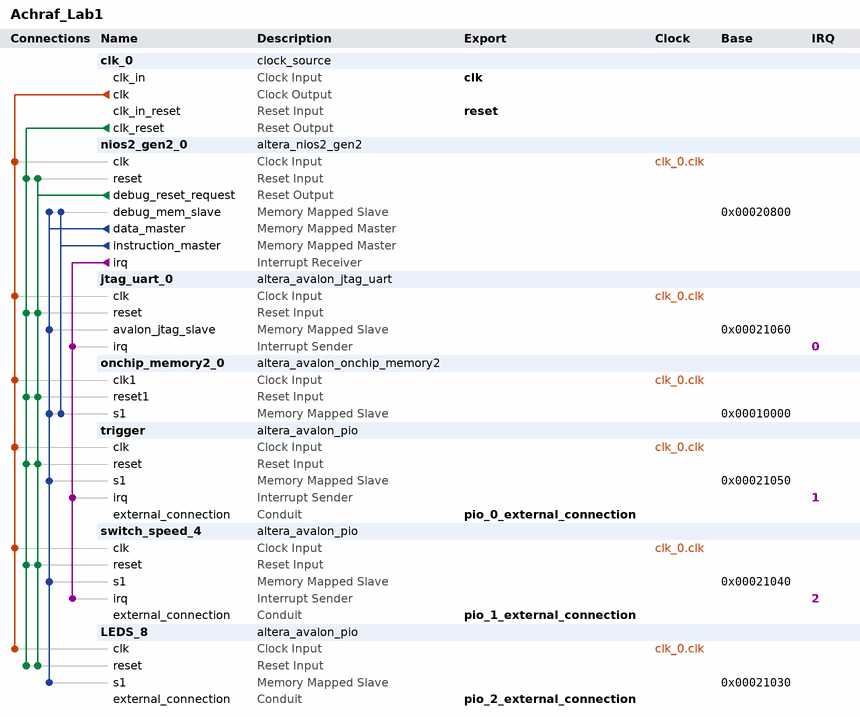
[diagram p0: system contents]
# Platform Designer (Qsys) system Achraf_Lab1, MAX 10 10M50DAF484C7G
# Parameters at their usual value, and those the tool derives, are not listed.
package require -exact qsys 18.1
create_system Achraf_Lab1
set_project_property DEVICE_FAMILY {MAX 10}
set_project_property DEVICE 10M50DAF484C7G

add_instance clk_0 clock_source 18.1
set_instance_parameter_value clk_0 clockFrequency 50000000

add_instance nios2_gen2_0 altera_nios2_gen2 18.1
set_instance_parameter_value nios2_gen2_0 dcache_size 2048
set_instance_parameter_value nios2_gen2_0 exceptionSlave onchip_memory2_0.s1
set_instance_parameter_value nios2_gen2_0 icache_size 4096
set_instance_parameter_value nios2_gen2_0 impl Tiny
set_instance_parameter_value nios2_gen2_0 resetSlave onchip_memory2_0.s1

add_instance jtag_uart_0 altera_avalon_jtag_uart 18.1
set_instance_parameter_value jtag_uart_0 simInteractiveOptions NO_INTERACTIVE_WINDOWS

add_instance onchip_memory2_0 altera_avalon_onchip_memory2 18.1
set_instance_parameter_value onchip_memory2_0 dataWidth 32
set_instance_parameter_value onchip_memory2_0 dualPort false
set_instance_parameter_value onchip_memory2_0 initMemContent true
set_instance_parameter_value onchip_memory2_0 initializationFileName E:/PortableGit/TAIBI_Lab1/software/app/mem_init/Achraf_Lab1_onchip_memory2_0.hex
set_instance_parameter_value onchip_memory2_0 memorySize 40000
set_instance_parameter_value onchip_memory2_0 useNonDefaultInitFile true

add_instance trigger altera_avalon_pio 18.1
set_instance_parameter_value trigger captureEdge true
set_instance_parameter_value trigger direction Input
set_instance_parameter_value trigger edgeType FALLING
set_instance_parameter_value trigger generateIRQ true
set_instance_parameter_value trigger irqType EDGE
set_instance_parameter_value trigger width 1

add_instance switch_speed_4 altera_avalon_pio 18.1
set_instance_parameter_value switch_speed_4 bitClearingEdgeCapReg true
set_instance_parameter_value switch_speed_4 captureEdge true
set_instance_parameter_value switch_speed_4 direction Input
set_instance_parameter_value switch_speed_4 edgeType FALLING
set_instance_parameter_value switch_speed_4 generateIRQ true
set_instance_parameter_value switch_speed_4 irqType EDGE
set_instance_parameter_value switch_speed_4 width 4

add_instance LEDS_8 altera_avalon_pio 18.1
set_instance_parameter_value LEDS_8 direction Output
set_instance_parameter_value LEDS_8 width 8

# connections
add_connection clk_0.clk jtag_uart_0.clk clock
add_connection clk_0.clk LEDS_8.clk clock
add_connection clk_0.clk nios2_gen2_0.clk clock
add_connection clk_0.clk onchip_memory2_0.clk1 clock
add_connection clk_0.clk switch_speed_4.clk clock
add_connection clk_0.clk trigger.clk clock
add_connection clk_0.clk_reset jtag_uart_0.reset reset
add_connection clk_0.clk_reset LEDS_8.reset reset
add_connection clk_0.clk_reset nios2_gen2_0.reset reset
add_connection clk_0.clk_reset onchip_memory2_0.reset1 reset
add_connection clk_0.clk_reset switch_speed_4.reset reset
add_connection clk_0.clk_reset trigger.reset reset
add_connection nios2_gen2_0.debug_reset_request jtag_uart_0.reset reset
add_connection nios2_gen2_0.debug_reset_request LEDS_8.reset reset
add_connection nios2_gen2_0.debug_reset_request nios2_gen2_0.reset reset
add_connection nios2_gen2_0.debug_reset_request onchip_memory2_0.reset1 reset
add_connection nios2_gen2_0.debug_reset_request switch_speed_4.reset reset
add_connection nios2_gen2_0.debug_reset_request trigger.reset reset
add_connection nios2_gen2_0.data_master jtag_uart_0.avalon_jtag_slave avalon
set_connection_parameter_value nios2_gen2_0.data_master/jtag_uart_0.avalon_jtag_slave baseAddress 0x00021060
add_connection nios2_gen2_0.data_master LEDS_8.s1 avalon
set_connection_parameter_value nios2_gen2_0.data_master/LEDS_8.s1 baseAddress 0x00021030
add_connection nios2_gen2_0.data_master nios2_gen2_0.debug_mem_slave avalon
set_connection_parameter_value nios2_gen2_0.data_master/nios2_gen2_0.debug_mem_slave baseAddress 0x00020800
add_connection nios2_gen2_0.data_master onchip_memory2_0.s1 avalon
set_connection_parameter_value nios2_gen2_0.data_master/onchip_memory2_0.s1 baseAddress 0x00010000
add_connection nios2_gen2_0.data_master switch_speed_4.s1 avalon
set_connection_parameter_value nios2_gen2_0.data_master/switch_speed_4.s1 baseAddress 0x00021040
add_connection nios2_gen2_0.data_master trigger.s1 avalon
set_connection_parameter_value nios2_gen2_0.data_master/trigger.s1 baseAddress 0x00021050
add_connection nios2_gen2_0.instruction_master nios2_gen2_0.debug_mem_slave avalon
set_connection_parameter_value nios2_gen2_0.instruction_master/nios2_gen2_0.debug_mem_slave baseAddress 0x00020800
add_connection nios2_gen2_0.instruction_master onchip_memory2_0.s1 avalon
set_connection_parameter_value nios2_gen2_0.instruction_master/onchip_memory2_0.s1 baseAddress 0x00010000
add_connection nios2_gen2_0.irq jtag_uart_0.irq interrupt
set_connection_parameter_value nios2_gen2_0.irq/jtag_uart_0.irq irqNumber 0
add_connection nios2_gen2_0.irq switch_speed_4.irq interrupt
set_connection_parameter_value nios2_gen2_0.irq/switch_speed_4.irq irqNumber 2
add_connection nios2_gen2_0.irq trigger.irq interrupt
set_connection_parameter_value nios2_gen2_0.irq/trigger.irq irqNumber 1

# exported interfaces
add_interface clk clock sink
set_interface_property clk EXPORT_OF clk_0.clk_in
add_interface pio_0_external_connection conduit end
set_interface_property pio_0_external_connection EXPORT_OF trigger.external_connection
add_interface pio_1_external_connection conduit end
set_interface_property pio_1_external_connection EXPORT_OF switch_speed_4.external_connection
add_interface pio_2_external_connection conduit end
set_interface_property pio_2_external_connection EXPORT_OF LEDS_8.external_connection
add_interface reset reset sink
set_interface_property reset EXPORT_OF clk_0.clk_in_reset

set_interconnect_requirement {$system} qsys_mm.clockCrossingAdapter HANDSHAKE
set_interconnect_requirement {$system} qsys_mm.enableEccProtection FALSE
set_interconnect_requirement {$system} qsys_mm.insertDefaultSlave FALSE
set_interconnect_requirement {$system} qsys_mm.maxAdditionalLatency 1

save_system Achraf_Lab1.qsys
